# EAGLE design RamyunControlBoard (EAGLE 8.0.0)
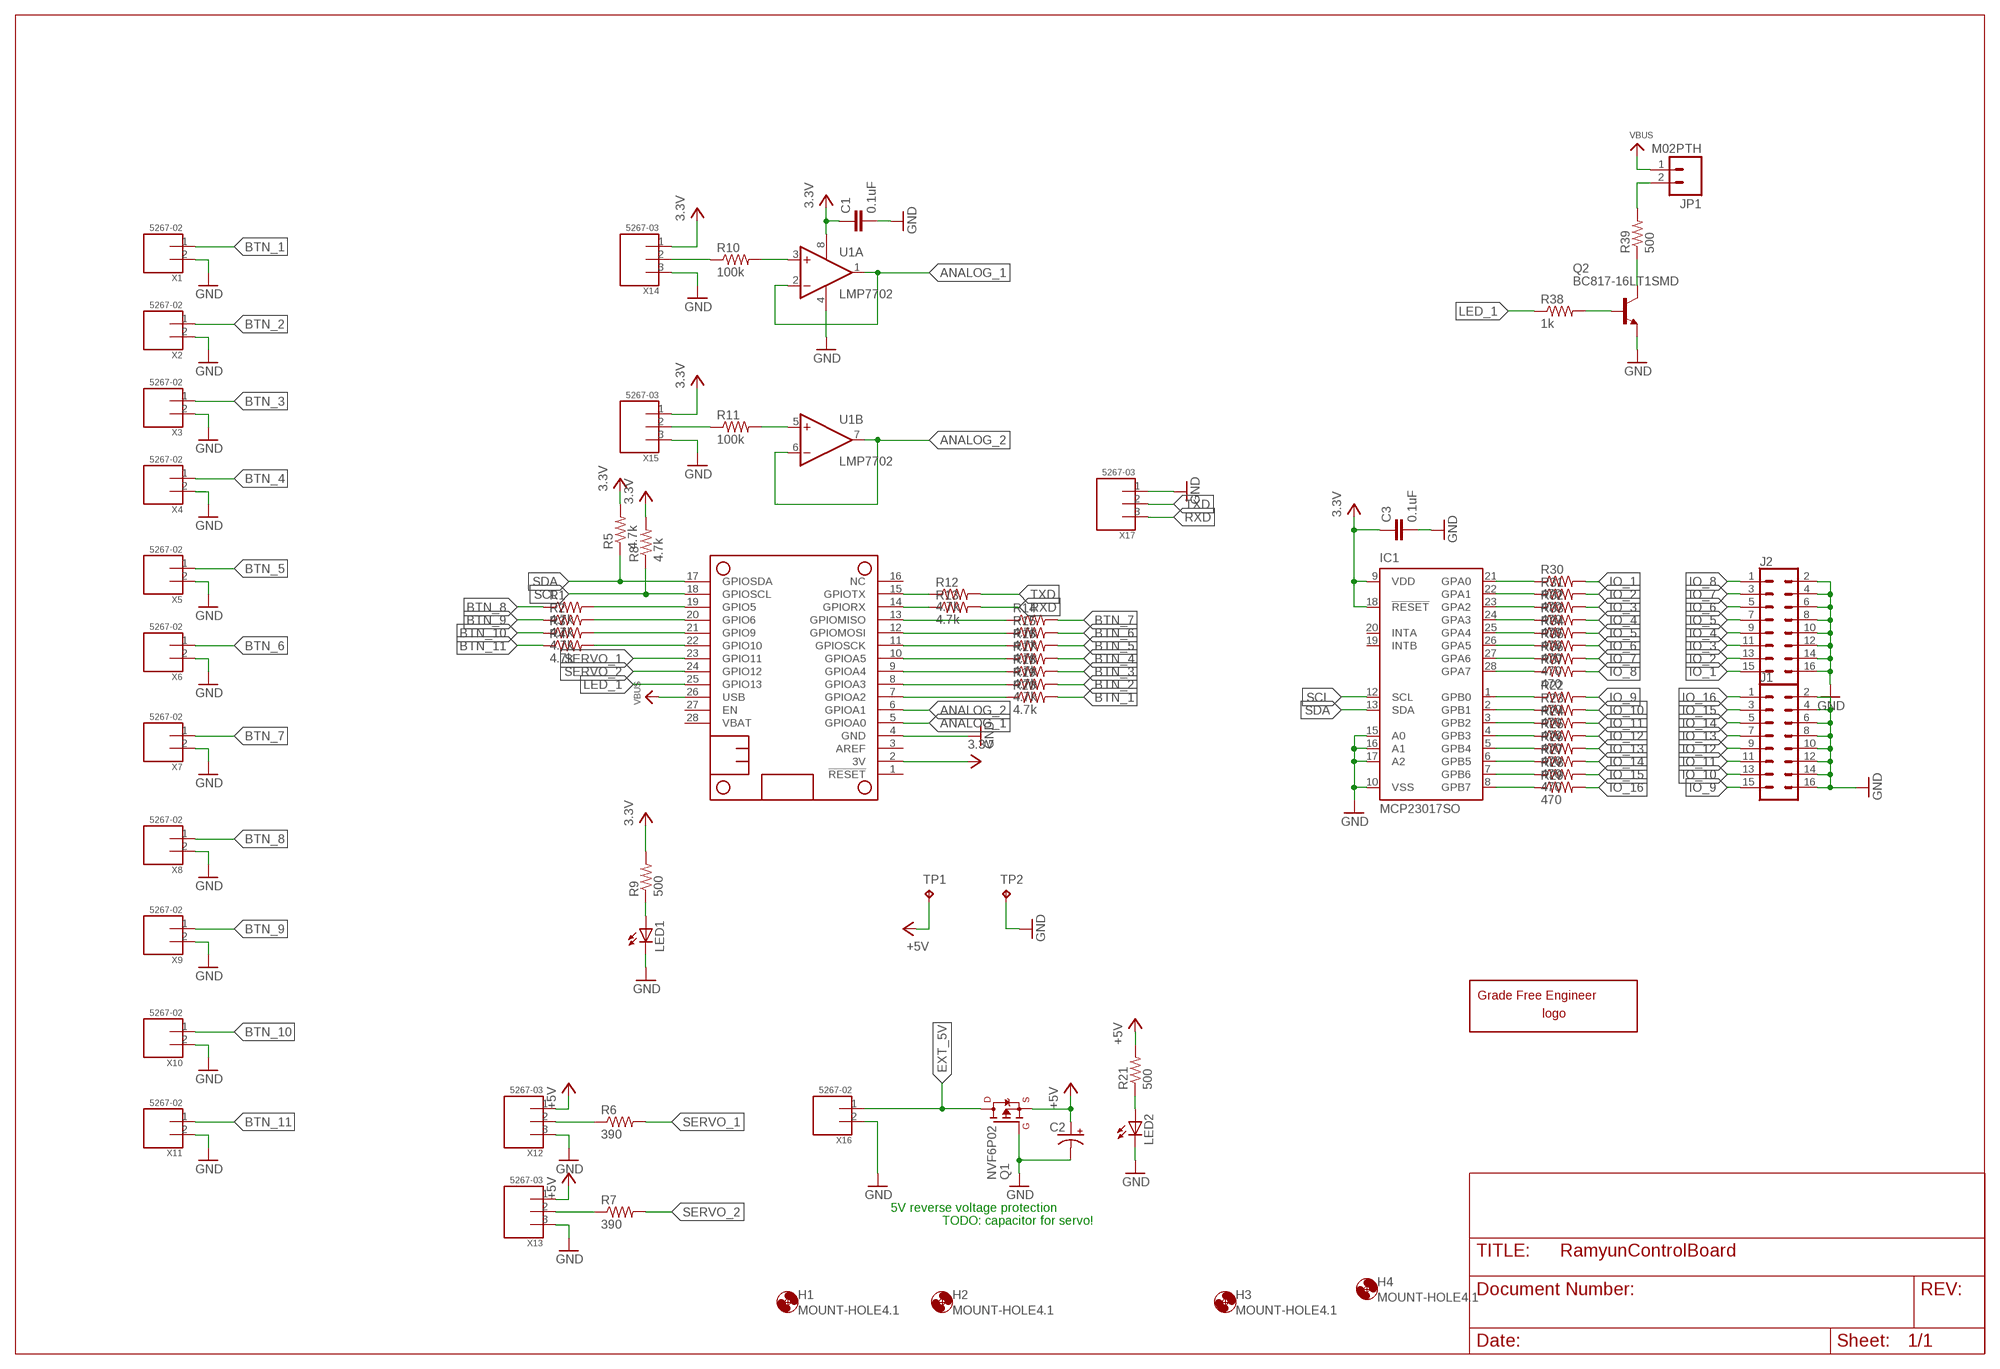
[diagram p0: schematic, sheet 1]

## Parts
C1  0.1uF  C0603(1608)_HAND  [C0603(1608)_HANDSOLDER]
C2  CPOL-USE3.5-8  [E3,5-8]
C3  0.1uF  C0603(1608)_HAND  [C0603(1608)_HANDSOLDER]
H1  MOUNT-HOLE4.1  [4,1]
H2  MOUNT-HOLE4.1  [4,1]
H3  MOUNT-HOLE4.1  [4,1]
H4  MOUNT-HOLE4.1  [4,1]
IC1  MCP23017SO  [SO28W]
J1  CONN_08X2  [2X8]
J2  CONN_08X2  [2X8]
JP1  M02PTH  [1X02]
LED1  LED3MM  [LED3MM]
LED2  LED3MM  [LED3MM]
LOGO1  GRADEFREELOGO-20  [GRADEFREELOGO-20]
MS1  FEATHERWING_NODIM  [FEATHERWING_DIM]
Q1  NVF6P02  [SOT223]
Q2  BC817-16LT1SMD  [SOT23-BEC]
R1  4.7k  R0603(1608)_HAND  [R0603(1608)_HANDSOLDER]
R2  4.7k  R0603(1608)_HAND  [R0603(1608)_HANDSOLDER]
R3  4.7k  R0603(1608)_HAND  [R0603(1608)_HANDSOLDER]
R4  4.7k  R0603(1608)_HAND  [R0603(1608)_HANDSOLDER]
R5  4.7k  R0603(1608)_HAND  [R0603(1608)_HANDSOLDER]
R6  390  R0603(1608)_HAND  [R0603(1608)_HANDSOLDER]
R7  390  R0603(1608)_HAND  [R0603(1608)_HANDSOLDER]
R8  4.7k  R0603(1608)_HAND  [R0603(1608)_HANDSOLDER]
R9  500  R0603(1608)_HAND  [R0603(1608)_HANDSOLDER]
R10  100k  R0603(1608)_HAND  [R0603(1608)_HANDSOLDER]
R11  100k  R0603(1608)_HAND  [R0603(1608)_HANDSOLDER]
R12  4.7k  R0603(1608)_HAND  [R0603(1608)_HANDSOLDER]
R13  4.7k  R0603(1608)_HAND  [R0603(1608)_HANDSOLDER]
R14  4.7k  R0603(1608)_HAND  [R0603(1608)_HANDSOLDER]
R15  4.7k  R0603(1608)_HAND  [R0603(1608)_HANDSOLDER]
R16  4.7k  R0603(1608)_HAND  [R0603(1608)_HANDSOLDER]
R17  4.7k  R0603(1608)_HAND  [R0603(1608)_HANDSOLDER]
R18  4.7k  R0603(1608)_HAND  [R0603(1608)_HANDSOLDER]
R19  4.7k  R0603(1608)_HAND  [R0603(1608)_HANDSOLDER]
R20  4.7k  R0603(1608)_HAND  [R0603(1608)_HANDSOLDER]
R21  500  R0603(1608)_HAND  [R0603(1608)_HANDSOLDER]
R22  470  R0603(1608)_HAND  [R0603(1608)_HANDSOLDER]
R23  470  R0603(1608)_HAND  [R0603(1608)_HANDSOLDER]
R24  470  R0603(1608)_HAND  [R0603(1608)_HANDSOLDER]
R25  470  R0603(1608)_HAND  [R0603(1608)_HANDSOLDER]
R26  470  R0603(1608)_HAND  [R0603(1608)_HANDSOLDER]
R27  470  R0603(1608)_HAND  [R0603(1608)_HANDSOLDER]
R28  470  R0603(1608)_HAND  [R0603(1608)_HANDSOLDER]
R29  470  R0603(1608)_HAND  [R0603(1608)_HANDSOLDER]
R30  470  R0603(1608)_HAND  [R0603(1608)_HANDSOLDER]
R31  470  R0603(1608)_HAND  [R0603(1608)_HANDSOLDER]
R32  470  R0603(1608)_HAND  [R0603(1608)_HANDSOLDER]
R33  470  R0603(1608)_HAND  [R0603(1608)_HANDSOLDER]
R34  470  R0603(1608)_HAND  [R0603(1608)_HANDSOLDER]
R35  470  R0603(1608)_HAND  [R0603(1608)_HANDSOLDER]
R36  470  R0603(1608)_HAND  [R0603(1608)_HANDSOLDER]
R37  470  R0603(1608)_HAND  [R0603(1608)_HANDSOLDER]
R38  1k  R0603(1608)_HAND  [R0603(1608)_HANDSOLDER]
R39  500  R0603(1608)_HAND  [R0603(1608)_HANDSOLDER]
TP1  TP-5010  [TP-5010]
TP2  TP-5010  [TP-5010]
U1  LMP7702  [DGK_S-DPSO-G8]
X1  5267-02  [5267-02]
X2  5267-02  [5267-02]
X3  5267-02  [5267-02]
X4  5267-02  [5267-02]
X5  5267-02  [5267-02]
X6  5267-02  [5267-02]
X7  5267-02  [5267-02]
X8  5267-02  [5267-02]
X9  5267-02  [5267-02]
X10  5267-02  [5267-02]
X11  5267-02  [5267-02]
X12  5267-03  [5267-03]
X13  5267-03  [5267-03]
X14  5267-03  [5267-03]
X15  5267-03  [5267-03]
X16  5267-02  [5267-02]
X17  5267-03  [5267-03]

## Nets
3.3V: C1.1 C3.1 IC1.9(VDD) IC1.18(!RESET) MS1.2(3V) R5.2 R8.2 R9.2 U1.8(V+) X14.1 X15.1
+5V: C2.+ Q1.3(S) R21.2 TP1.TP X12.1 X13.1
ANALOG_1: MS1.5(GPIOA0) U1.1(A:OUT) U1.2(A:-IN)
ANALOG_2: MS1.6(GPIOA1) U1.6(B:-IN) U1.7(B:OUT)
BTN_1: R20.2 X1.1
BTN_2: R19.2 X2.1
BTN_3: R18.2 X3.1
BTN_4: R17.2 X4.1
BTN_5: R16.2 X5.1
BTN_6: R15.2 X6.1
BTN_7: R14.2 X7.1
BTN_8: R1.1 X8.1
BTN_9: R2.1 X9.1
BTN_10: R3.1 X10.1
BTN_11: R4.1 X11.1
EXT_5V: Q1.2(D) Q1.4(D) X16.1
GND: C1.2 C2.- C3.2 IC1.10(VSS) IC1.15(A0) IC1.16(A1) IC1.17(A2) J1.2 J1.4 J1.6 J1.8 J1.10 J1.12 J1.14 J1.16 J2.2 J2.4 J2.6 J2.8 J2.10 J2.12 J2.14 J2.16 LED1.K(C) LED2.K(C) MS1.4(GND) Q1.1(G) Q2.E TP2.TP U1.4(V-) X1.2 X2.2 X3.2 X4.2 X5.2 X6.2 X7.2 X8.2 X9.2 X10.2 X11.2 X12.3 X13.3 X14.3 X15.3 X16.2 X17.1
IO_1: J2.15 R30.2
IO_2: J2.13 R31.2
IO_3: J2.11 R32.2
IO_4: J2.9 R33.2
IO_5: J2.7 R34.2
IO_6: J2.5 R35.2
IO_7: J2.3 R36.2
IO_8: J2.1 R37.2
IO_9: J1.15 R22.2
IO_10: J1.13 R23.2
IO_11: J1.11 R24.2
IO_12: J1.9 R25.2
IO_13: J1.7 R26.2
IO_14: J1.5 R27.2
IO_15: J1.3 R28.2
IO_16: J1.1 R29.2
LED_1: MS1.25(GPIO13) R38.1
N$1: MS1.7(GPIOA2) R20.1
N$2: R10.2 U1.3(A:+IN)
N$3: R11.2 U1.5(B:+IN)
N$4: MS1.8(GPIOA3) R19.1
N$5: MS1.9(GPIOA4) R18.1
N$6: MS1.10(GPIOA5) R17.1
N$7: R11.1 X15.2
N$8: R10.1 X14.2
N$9: MS1.19(GPIO5) R1.2
N$10: MS1.20(GPIO6) R2.2
N$11: MS1.21(GPIO9) R3.2
N$12: MS1.22(GPIO10) R4.2
N$13: MS1.15(GPIOTX) R12.1
N$14: MS1.14(GPIORX) R13.1
N$15: MS1.11(GPIOSCK) R16.1
N$16: MS1.12(GPIOMOSI) R15.1
N$17: MS1.13(GPIOMISO) R14.1
N$18: IC1.21(GPA0) R30.1
N$19: IC1.22(GPA1) R31.1
N$20: IC1.23(GPA2) R32.1
N$21: IC1.24(GPA3) R33.1
N$22: IC1.25(GPA4) R34.1
N$23: IC1.26(GPA5) R35.1
N$24: IC1.27(GPA6) R36.1
N$25: IC1.28(GPA7) R37.1
N$26: IC1.1(GPB0) R22.1
N$27: IC1.2(GPB1) R23.1
N$28: IC1.3(GPB2) R24.1
N$29: IC1.4(GPB3) R25.1
N$30: IC1.5(GPB4) R26.1
N$31: IC1.6(GPB5) R27.1
N$32: IC1.7(GPB6) R28.1
N$33: IC1.8(GPB7) R29.1
N$34: R6.1 X12.2
N$35: R7.1 X13.2
N$36: LED2.A R21.1
N$50: Q2.C R39.1
N$51: Q2.B R38.2
N$52: JP1.2 R39.2
N$53: LED1.A R9.1
RXD: R13.2 X17.3
SCL: IC1.12(SCL) MS1.18(GPIOSCL) R8.1
SDA: IC1.13(SDA) MS1.17(GPIOSDA) R5.1
SERVO_1: MS1.23(GPIO11) R6.2
SERVO_2: MS1.24(GPIO12) R7.2
TXD: R12.2 X17.2
VBUS: JP1.1 MS1.26(USB)
Unconnected: IC1.19(INTB) IC1.20(INTA) MS1.1(!RESET) MS1.3(AREF) MS1.16(NC) MS1.27(EN) MS1.28(VBAT)

## Notes on the sheet
- 5V reverse voltage protection
- TODO: capacitor for servo!

## Library data of the parts
C1 C3 = GFE:C
C2 = adafruit:CPOL-US: POLARIZED CAPACITOR, American symbol
H1-H4 = holes:MOUNT-HOLE: MOUNTING HOLE with drill center marker
IC1 = GFE:MCP23017: http://ww1.microchip.com/downloads/en/DeviceDoc/21952a.pdf Source: http://ww1.microchip.com/downloads/en/DeviceDoc/21952a.pdf
J1 J2 = SparkFun-Connectors:CONN_08X2: Multi connection point. Often used as Generic Header-pin footprint for 0.1 inch spaced/style header connections You can populate with any combo of single row headers, but if you'd like an exact match, check this: Header - 2x8 (Male, 0.1") <https://www.sparkfun.com/products/13156> (PRT-13156) On any of the 0.1 inch spaced packages, you can populate with these: Break Away Headers - Straight <https://www.sparkfun.com/products/116> (PRT-00116) Break Away Male Headers - Right Angle <https://www.sparkfun.com/products/553> (PRT-00553) Female Headers <https://www.sparkfun.com/products/115> (PRT-00115) Break Away Headers - Machine Pin <https://www.sparkfun.com/products/117> (PRT-00117) Break Away Female Headers - Swiss Machine Pin <https://www.sparkfun.com/products/743> (PRT-00743)
JP1 = berry:M02: Standard 2-pin 0.1" header. Use with - straight break away headers ( PRT-00116) - right angle break away headers (PRT-00553) - swiss pins (PRT-00743) - machine pins (PRT-00117) - female headers (PRT-00115) Molex polarized connector foot print use with: PRT-08233 with associated crimp pins and housings. 2.54_SCREWTERM for use with PRT-10571. 3.5mm Screw Terminal footprints for PRT-08084 5mm Screw Terminal footprints for use with PRT-08433
LED1 LED2 = GFE:LED: LEDs Standard schematic elements and footprints for 5mm, 3mm, 1206, and 0603 sized LEDs. 5mm - Spark Fun Electronics SKU : COM-00529 (and others)
LOGO1 = GFE:GRADEFREELOGO
MS1 = GFE:FEATHERWING
Q1 = GFE:NVF6P02
Q2 = GFE:BC817*: NPN Transistor
R1-R39 = GFE:R
TP1 TP2 = berry:TP
U1 = GFE:LMP7702
X1-X11 X16 = GFE:5267-02
X12-X15 X17 = GFE:5267-03

## Board
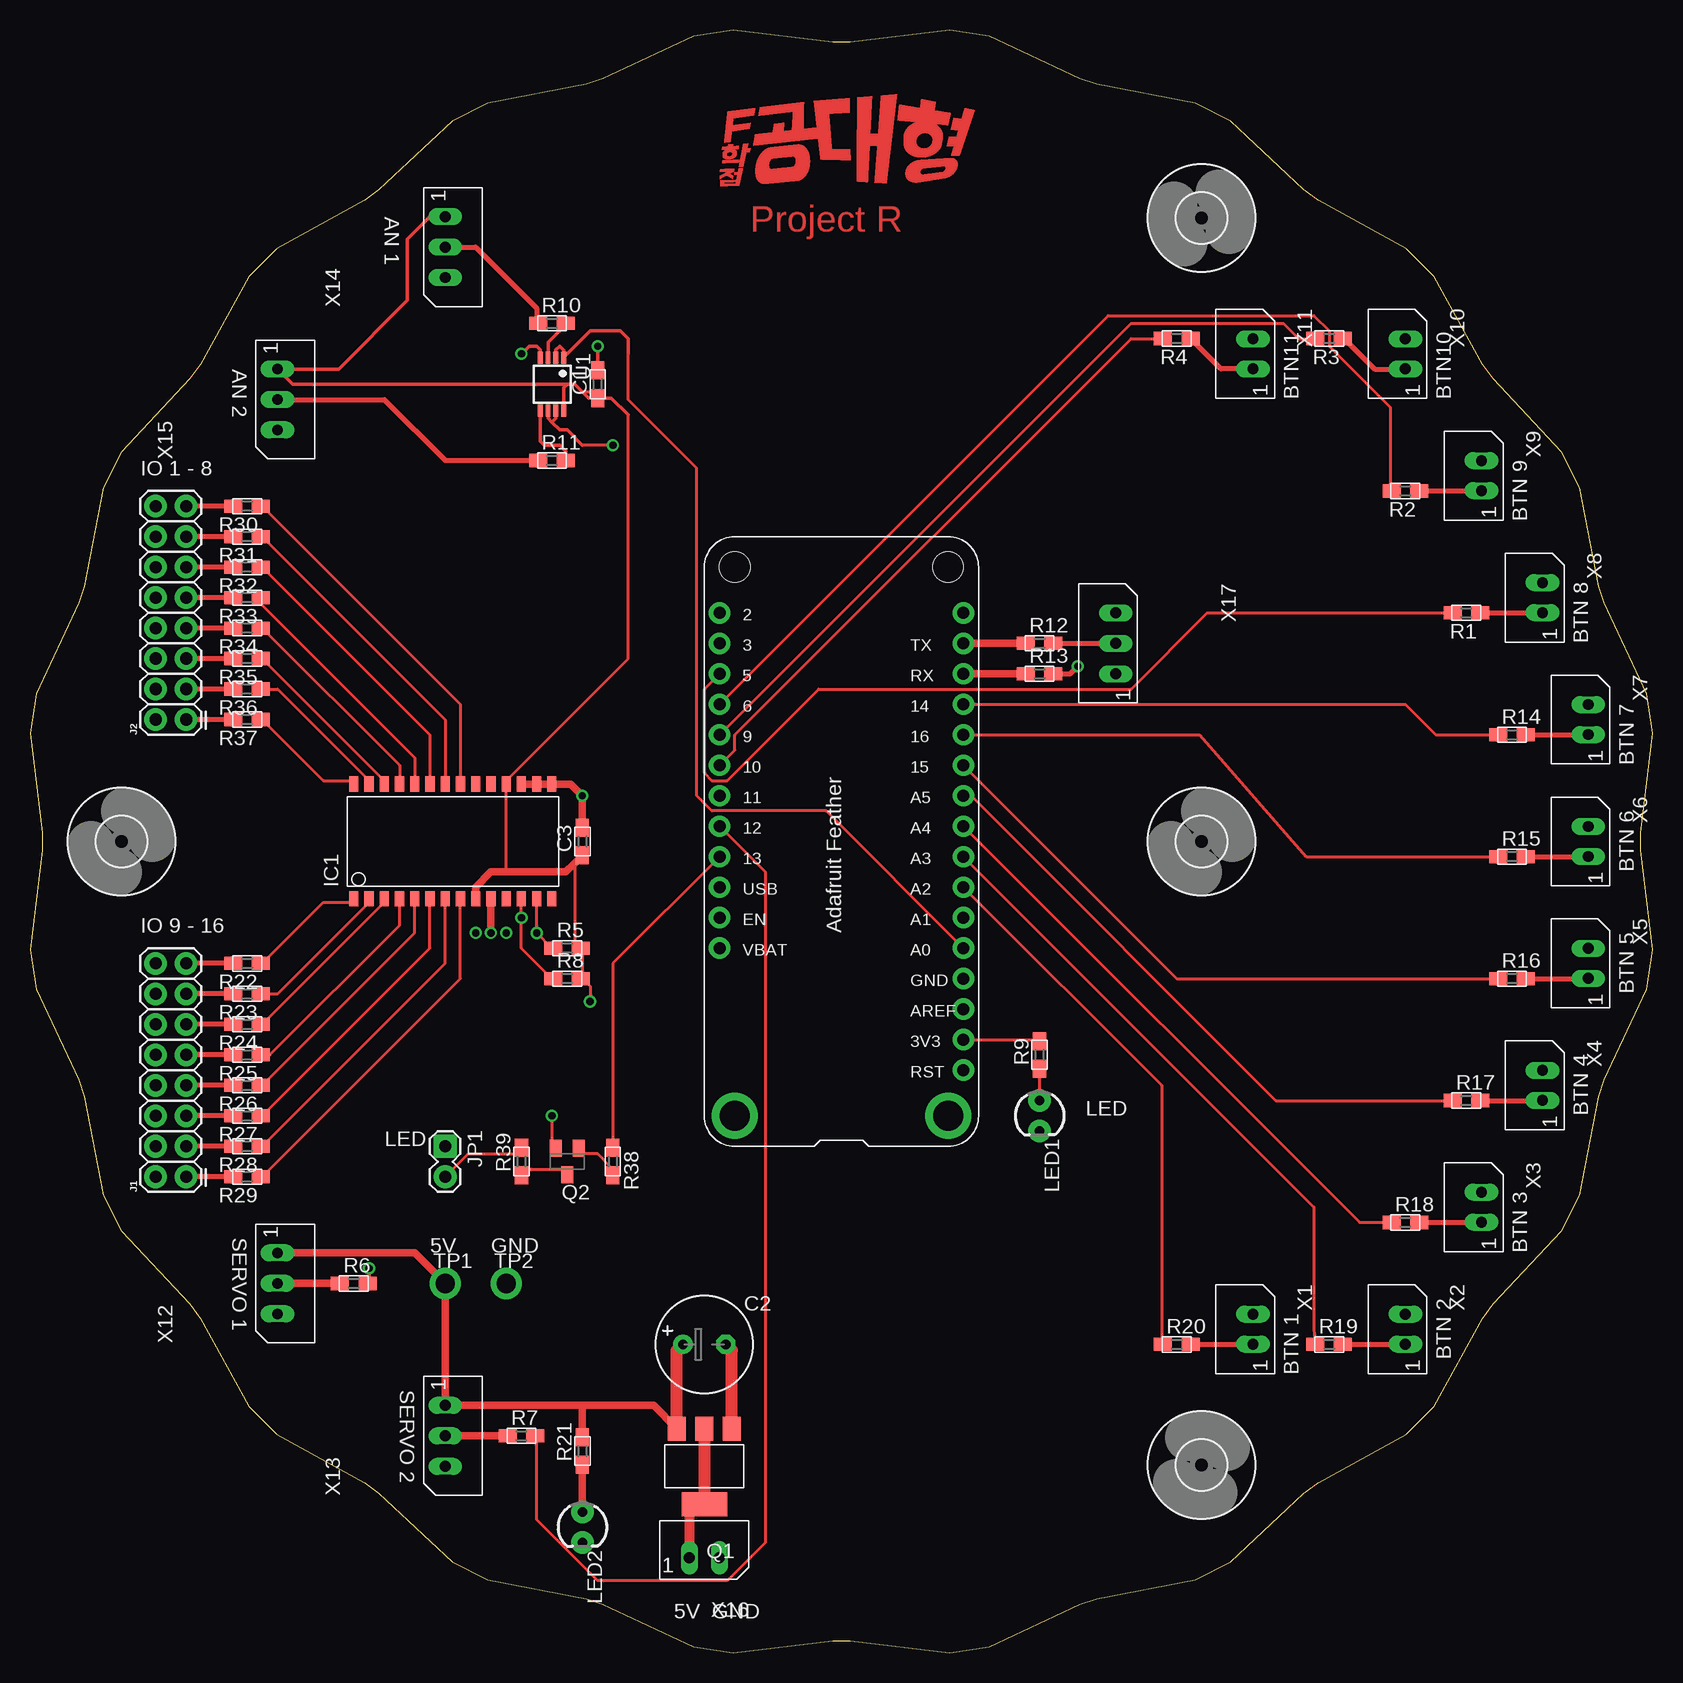
[diagram p1: board, top side]
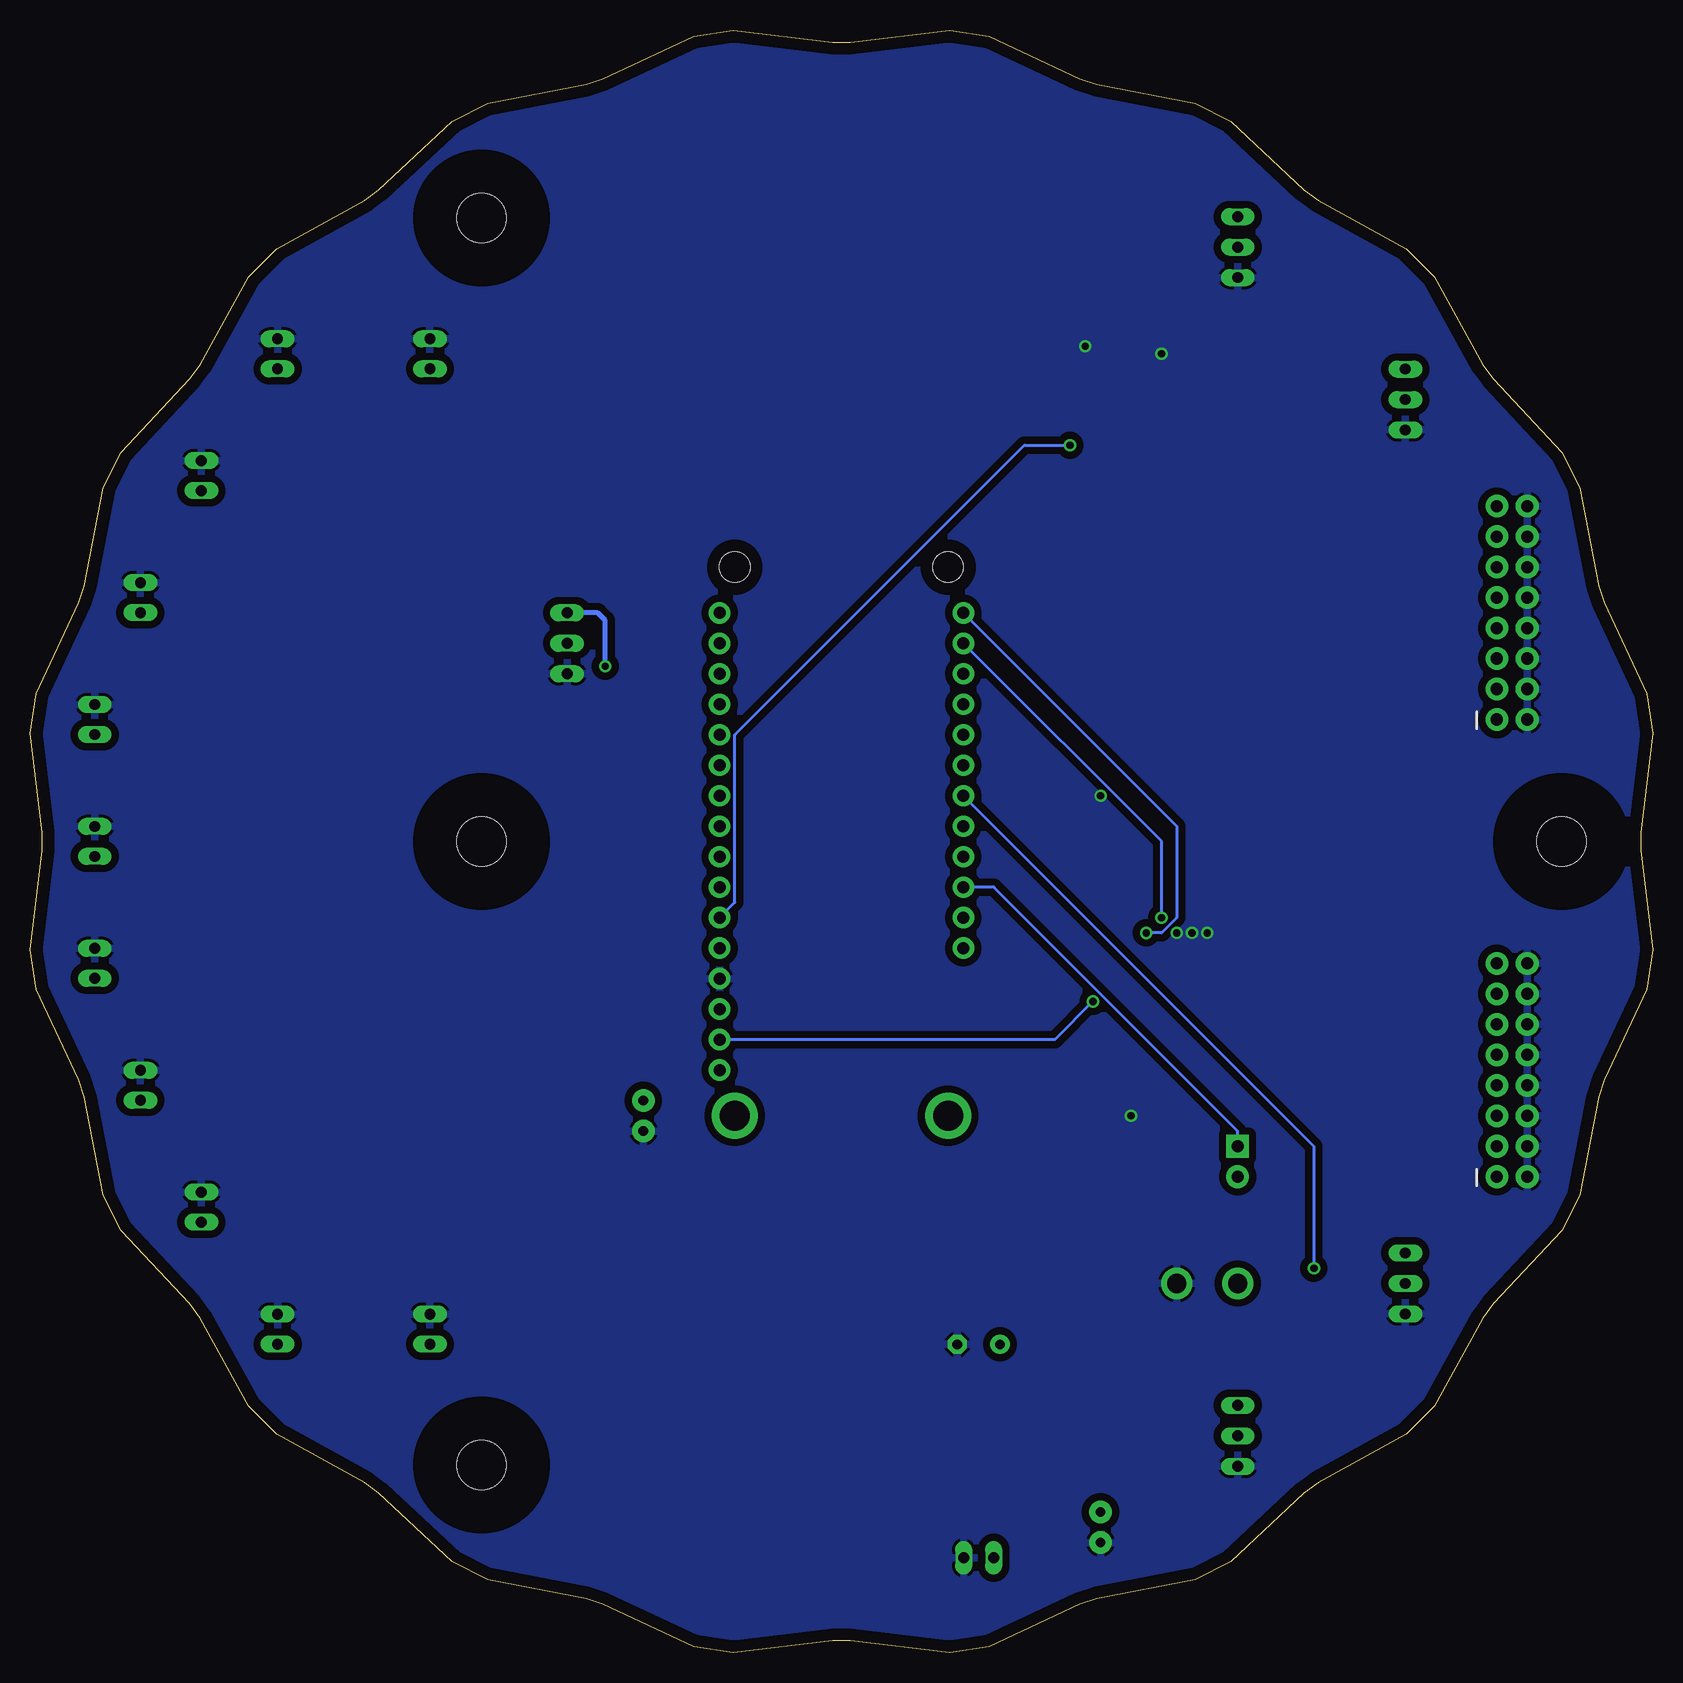
[diagram p2: board, bottom side, seen from below]

Size 135.24 x 135.24 mm. Coordinates in mm from the lower left corner, seen from the top.
Outline: 46.34,4.52 47.75,4.06 55.31,0.52 58.6,0 66.88,1.03 68.36,1.03 76.65,0 79.93,0.52 87.5,4.06 88.9,4.52 97.1,6.1 100.07,7.61 106.17,13.31 107.36,14.18 114.67,18.22 117.02,20.57 121.06,27.88 121.93,29.08 127.64,35.18 129.15,38.14 130.73,46.34 131.18,47.75 134.72,55.31 135.24,58.6 134.21,66.88 134.21,68.36 135.24,76.65 134.72,79.93 131.18,87.5 130.73,88.9 129.15,97.1 127.64,100.07 121.93,106.17 121.06,107.36 117.02,114.67 114.67,117.02 107.36,121.06 106.17,121.93 100.07,127.64 97.1,129.15 88.9,130.73 87.5,131.18 79.93,134.72 76.65,135.24 68.36,134.21 66.88,134.21 58.6,135.24 55.31,134.72 47.75,131.18 46.34,130.73 38.14,129.15 35.18,127.64 29.08,121.93 27.88,121.06 20.57,117.02 18.22,114.67 14.18,107.36 13.31,106.17 7.61,100.07 6.1,97.1 4.52,88.9 4.06,87.5 0.52,79.93 0,76.65 1.03,68.36 1.03,66.88 0,58.6 0.52,55.31 4.06,47.75 4.52,46.34 6.1,38.14 7.61,35.18 13.31,29.08 14.18,27.88 18.22,20.57 20.57,18.22 27.88,14.18 29.08,13.31 35.18,7.61 38.14,6.1 46.34,4.52
Copper layers (1*16): Top 0.035mm / dielectric 1.5mm / Bottom 0.035mm
Design rules "default": minimum track width 10mil, minimum drill 24mil, track to track 8mil, track to pad 8mil, pad to pad 8mil, via to via 8mil, smd to smd 8mil, copper to edge 40mil, drill to drill 8mil, minimum pad ring 10mil, minimum via ring 8mil, stop-mask expansion 4mil, vias tented up to drill 0mil, thermal gap 10mil

### Footprints (pad centres in the part's own frame; a part is rotated, then mirrored left to right if it is on the bottom)
C0603(1608)_HANDSOLDER = smd 1.5 x 1.1: 1 -1.15,0; 2 1.15,0
E3,5-8 = drill 0.813 pad 1.6: + -1.778,0 | drill 0.813 pad 1.6 octagon: - 1.778,0
4,1 = hole 4.1: 0,0
SO28W = smd 0.762 x 1.27: 1 -7.62,-4.78; 2 -6.35,-4.78; 3 -5.08,-4.78; 4 -3.81,-4.78; 5 -2.54,-4.78; 6 -1.27,-4.78; 7 0,-4.78; 8 1.27,-4.78; 9 2.54,-4.78; 10 3.81,-4.78; 11 5.08,-4.78; 12 6.35,-4.78; 13 7.62,-4.78; 14 8.89,-4.78; 15 8.89,4.78; 16 7.62,4.78; 17 6.35,4.78; 18 5.08,4.78; 19 3.81,4.78; 20 2.54,4.78; 21 1.27,4.78; 22 0,4.78; 23 -1.27,4.78; 24 -2.54,4.78; 25 -3.81,4.78; 26 -5.08,4.78; 27 -6.35,4.78; 28 -7.62,4.78
2X8 = drill 1.016 pad 1.88: 1 0,0; 2 0,2.54; 3 2.54,0; 4 2.54,2.54; 5 5.08,0; 6 5.08,2.54; 7 7.62,0; 8 7.62,2.54; 9 10.16,0; 10 10.16,2.54; 11 12.7,0; 12 12.7,2.54; 13 15.24,0; 14 15.24,2.54; 15 17.78,0; 16 17.78,2.54
1X02 = drill 1.016 pad 1.88 square: 1 0,0 | drill 1.016 pad 1.88: 2 2.54,0
LED3MM = drill 0.813 pad 1.88: A -1.27,0; K 1.27,0
FEATHERWING_DIM = drill 1 pad 1.778: 1 -19.05,-10.16; 2 -16.51,-10.16; 3 -13.97,-10.16; 4 -11.43,-10.16; 5 -8.89,-10.16; 6 -6.35,-10.16; 7 -3.81,-10.16; 8 -1.27,-10.16; 9 1.27,-10.16; 10 3.81,-10.16; 11 6.35,-10.16; 12 8.89,-10.16; 13 11.43,-10.16; 14 13.97,-10.16; 15 16.51,-10.16; 16 19.05,-10.16; 17 19.05,10.16; 18 16.51,10.16; 19 13.97,10.16; 20 11.43,10.16; 21 8.89,10.16; 22 6.35,10.16; 23 3.81,10.16; 24 1.27,10.16; 25 -1.27,10.16; 26 -3.81,10.16; 27 -6.35,10.16; 28 -8.89,10.16 | drill 2.5 pad 3.81: P$1 -22.86,8.89; P$2 -22.86,-8.89 | hole 2.54: 22.86,8.89; 22.86,-8.89
SOT223 = smd 1.5 x 2: 1 -2.3,-3.15; 2 0,-3.15; 3 2.3,-3.15 | smd 3.8 x 2: 4 0,3.15
SOT23-BEC = smd 1 x 1.4: B -0.95,-1.1; C 0,1.1; E 0.95,-1.1
R0603(1608)_HANDSOLDER = smd 1.5 x 1.1: 1 -1.15,0; 2 1.15,0
TP-5010 = drill 1.6 pad 2.6: TP 0,0
DGK_S-DPSO-G8 = smd 0.4 x 1: 1 -0.975,-2.2; 2 -0.325,-2.2; 3 0.325,-2.2; 4 0.975,-2.2; 5 0.975,2.2; 6 0.325,2.2; 7 -0.325,2.2; 8 -0.975,2.2
5267-02 = drill 0.9 long: 1 1.25,0; 2 -1.25,0
5267-03 = drill 0.9 long: 1 2.54,0; 2 0,0; 3 -2.54,0

### Placement (x,y rotation side)
C1  47.3,105.72 90 top
C2  56.19,25.71 0 top
C3  46.03,67.62 90 top
H1  97.62,15.66 30 top
H2  97.62,119.58 330 top
H3  7.62,67.62 0 top
H4  97.62,67.62 0 top
IC1  34.6,67.62 0 top
J1  13.01,39.68 90 top
J2  13.01,77.78 90 top
JP1  34.6,42.22 270 top
LED1  84.13,44.76 270 top
LED2  46.03,10.47 270 top
LOGO1  57.46,122.23 0 top
MS1  67.62,67.62 90 top
Q1  56.19,15.55 180 top
Q2  44.76,40.95 180 top
R1  119.69,86.67 180 top
R2  114.61,96.83 180 top
R3  108.26,109.53 180 top
R4  95.56,109.53 180 top
R5  44.76,58.73 0 top
R6  26.98,30.79 0 top
R7  40.95,18.09 0 top
R8  44.76,56.19 0 top
R9  84.13,49.84 90 top
R10  43.49,110.8 0 top
R11  43.49,99.37 0 top
R12  84.13,84.13 0 top
R13  84.13,81.59 0 top
R14  123.5,76.51 0 top
R15  123.5,66.35 0 top
R16  123.5,56.19 0 top
R17  119.69,46.03 0 top
R18  114.61,35.87 0 top
R19  108.26,25.71 0 top
R20  95.56,25.71 0 top
R21  46.03,16.82 90 top
R22  18.09,57.46 180 top
R23  18.09,54.92 180 top
R24  18.09,52.38 180 top
R25  18.09,49.84 180 top
R26  18.09,47.3 180 top
R27  18.09,44.76 180 top
R28  18.09,42.22 180 top
R29  18.09,39.68 180 top
R30  18.09,95.56 180 top
R31  18.09,93.02 180 top
R32  18.09,90.48 180 top
R33  18.09,87.94 180 top
R34  18.09,85.4 180 top
R35  18.09,82.86 180 top
R36  18.09,80.32 180 top
R37  18.09,77.78 180 top
R38  48.57,40.95 270 top
R39  40.95,40.95 90 top
TP1  34.6,30.79 0 top
TP2  39.68,30.79 0 top
U1  43.49,105.72 180 top
X1  101.91,26.98 270 top
X2  114.61,26.98 270 top
X3  120.96,37.14 270 top
X4  126.04,47.3 270 top
X5  129.85,57.46 270 top
X6  129.85,67.62 270 top
X7  129.85,77.78 270 top
X8  126.04,87.94 270 top
X9  120.96,98.1 270 top
X10  114.61,108.26 270 top
X11  101.91,108.26 270 top
X12  20.63,30.79 90 top
X13  34.6,18.09 90 top
X14  34.6,117.15 90 top
X15  20.63,104.45 90 top
X16  56.19,7.93 180 top
X17  90.48,84.13 270 top

### Tracks (layer width: path | path; a pad name or v marks a point on that pad's centre or on a via)
3.3V  (via drill 0.61)
  Top 0.254: MS1.2 84.13,51.11 R9.2 | 46.03,56.19 46.03,58.73 R5.2 45.4,58.73 45.4,65.72 45.34,65.78 | 46.03,105.09 47.3,105.09 C1.1 | 39.68,65.08 IC1.18 39.68,72.7 49.84,82.86 49.84,103.18 | v46.67,54.29 46.67,55.56 46.03,56.19 | 46.03,56.19 R8.2
  Top 0.305: 46.55,104.57 46.03,105.09 45.4,105.72 44.76,105.72 | 44.76,105.72 21.9,105.72 X15.1 25.71,106.99 31.43,112.71 31.43,117.79 33.33,119.69 X14.1 | C1.1 48.45,104.57 49.84,103.18 | U1.8 44.47,105.43 44.76,105.72
  Top 0.61: IC1.9 37.14,63.81 38.41,65.08 39.68,65.08 44.64,65.08 45.34,65.78 C3.1
  Bottom 0.254: MS1.2 49.84,51.11 v46.67,54.29
+5V
  Top 0.61: X12.1 32.06,33.33 TP1.TP X13.1 46.03,20.63 | 46.03,20.63 51.96,20.63 Q1.3 | R21.2 46.03,20.63
  Top 1.016: Q1.3 53.89,25.19 C2.+
ANALOG_1
  Top 0.254: 49.84,108.26 49.84,104.45 55.56,98.74 55.56,71.43 56.83,70.16 66.35,70.16 MS1.5
  Top 0.305: U1.2 43.82,108.59 44.13,108.9 44.47,108.56 U1.1 44.47,107.97 46.67,110.17 49.21,110.17 49.84,109.53 49.84,108.26
ANALOG_2  (via drill 0.61)
  Top 0.254: v48.57,100.64 46.03,100.64
  Top 0.305: U1.6 43.17,102.87 43.49,102.55 | U1.7 43.82,102.87 43.49,102.55 | 43.49,102.55 44.13,101.91 44.76,101.91 46.03,100.64
  Bottom 0.254: v48.57,100.64 52.38,100.64 76.51,76.51 76.51,62.54 MS1.6
BTN_1
  Top 0.406: R20.2 101.89,25.71 X1.1
BTN_2
  Top 0.406: R19.2 114.59,25.71 X2.1
BTN_3
  Top 0.406: R18.2 120.94,35.87 X3.1
BTN_4
  Top 0.406: R17.2 126.02,46.03 X4.1
BTN_5
  Top 0.406: R16.2 129.83,56.19 X5.1
BTN_6
  Top 0.406: R15.2 129.83,66.35 X6.1
BTN_7
  Top 0.406: R14.2 129.83,76.51 X7.1
BTN_8
  Top 0.406: R1.1 126.02,86.67 X8.1
BTN_9
  Top 0.406: R2.1 120.94,96.83 X9.1
BTN_10
  Top 0.406: R3.1 109.53,109.53 112.07,106.99 114.59,106.99 X10.1
BTN_11
  Top 0.406: X11.1 99.23,107.01 R4.1
EXT_5V
  Top 0.813: Q1.4 55.58,12.4 54.92,11.74 54.92,7.95 X16.1
  Top 1.016: Q1.2 Q1.4
GND  (via drill 0.6)
  Top 0.254: v43.49,44.76 43.49,42.22 Q2.E
  Top 0.305: C1.2 v47.3,108.9 | U1.4 42.52,108.6 42.22,108.9 41.59,108.9 v40.95,108.26
  Top 0.61: IC1.10 v38.41,60 | C3.2 v46.03,71.43 45.06,72.4 IC1.15 IC1.16 IC1.17
  Top 1.016: Q1.1 58.49,25.19 C2.-
  other vias: 39.68,60 37.14,60
  pour Bottom (isolate 0.61): -2.23,62.77 -2.23,72.47 arc-90 64.04,137.47 72.47,137.47 arc-90 137.47,72.47 137.47,62.77 arc-90 72.47,-2.23 62.77,-2.23 arc-90
IO_1
  Top 0.406: R30.2 J2.15
IO_2
  Top 0.406: R31.2 J2.13
IO_3
  Top 0.406: R32.2 J2.11
IO_4
  Top 0.406: R33.2 J2.9
IO_5
  Top 0.406: R34.2 J2.7
IO_6
  Top 0.406: R35.2 J2.5
IO_7
  Top 0.406: R36.2 J2.3
IO_8
  Top 0.406: R37.2 J2.1
IO_9
  Top 0.406: R22.2 J1.15
IO_10
  Top 0.406: R23.2 J1.13
IO_11
  Top 0.406: R24.2 J1.11
IO_12
  Top 0.406: R25.2 J1.9
IO_13
  Top 0.406: R26.2 J1.7
IO_14
  Top 0.406: R27.2 J1.5
IO_15
  Top 0.406: R28.2 J1.3
IO_16
  Top 0.406: R29.2 J1.1
LED_1
  Top 0.254: R38.1 48.57,57.46 MS1.25
N$1
  Top 0.254: MS1.7 94.29,47.3 94.29,25.71 R20.1
N$2
  Top 0.305: U1.3 43.17,109.21 44.64,110.68 R10.2
N$3
  Top 0.305: R11.2 44.64,100.13 44.13,100.64 42.86,100.64 42.52,100.98 U1.5
N$4
  Top 0.254: MS1.8 106.99,37.14 106.99,26.98 R19.1
N$5
  Top 0.254: R18.1 110.8,35.87 MS1.9
N$6
  Top 0.254: R17.1 103.82,46.03 78.42,71.43 MS1.10
N$7
  Top 0.406: X15.2 29.52,104.45 34.6,99.37 R11.1
N$8
  Top 0.406: X14.2 37.14,117.15 42.22,112.07 42.22,110.92 R10.1
N$9
  Top 0.254: R1.2 98.1,86.67 91.75,80.32 65.72,80.32 58.1,72.7 56.83,72.7 56.19,73.34 56.19,80.32 MS1.19
N$10
  Top 0.254: MS1.20 89.85,111.44 106.99,111.44 108.26,110.17 108.26,108.9 113.34,103.82 113.34,96.83 R2.2
N$11
  Top 0.254: R3.2 105.72,109.53 104.45,110.8 91.75,110.8 MS1.21
N$12
  Top 0.254: R4.2 91.75,109.53 58.73,76.51 58.73,75.24 MS1.22
N$13
  Top 0.61: MS1.15 R12.1
N$14
  Top 0.61: MS1.14 R13.1
N$15
  Top 0.254: R16.1 95.56,56.19 MS1.11
N$16
  Top 0.254: R15.1 106.36,66.35 97.47,76.51 MS1.12
N$17
  Top 0.254: MS1.13 114.61,79.05 117.15,76.51 R14.1
N$18
  Top 0.254: IC1.21 35.87,79.05 19.36,95.56 R30.1
N$19
  Top 0.254: IC1.22 34.6,77.78 19.36,93.02 R31.1
N$20
  Top 0.254: IC1.23 33.33,76.51 19.36,90.48 R32.1
N$21
  Top 0.254: IC1.24 32.06,74.61 18.73,87.94 R33.1
N$22
  Top 0.254: IC1.25 30.79,73.97 19.36,85.4 R34.1
N$23
  Top 0.254: IC1.26 29.52,72.7 19.36,82.86 R35.1
N$24
  Top 0.254: R36.1 20.63,80.32 28.25,72.7 IC1.27
N$25
  Top 0.254: IC1.28 26.98,72.7 24.44,72.7 19.36,77.78 R37.1
N$26
  Top 0.254: IC1.1 26.98,62.54 24.44,62.54 19.36,57.46 R22.1
N$27
  Top 0.254: R23.1 20.63,54.92 28.25,62.54 IC1.2
N$28
  Top 0.254: IC1.3 29.52,62.54 19.36,52.38 R24.1
N$29
  Top 0.254: IC1.4 30.79,60.64 20,49.84 R25.1
N$30
  Top 0.254: IC1.5 32.06,60 19.36,47.3 R26.1
N$31
  Top 0.254: IC1.6 33.33,58.73 19.36,44.76 R27.1
N$32
  Top 0.254: IC1.7 34.6,57.46 19.36,42.22 R28.1
N$33
  Top 0.254: IC1.8 35.87,56.19 19.36,39.68 R29.1
N$34
  Top 0.61: R6.1 X12.2
N$35
  Top 0.61: X13.2 R7.1
N$36
  Top 0.61: R21.1 LED2.A
N$50
  Top 0.254: Q2.C 44.76,40.32 40.95,40.32 R39.1
N$51
  Top 0.254: Q2.B 46.03,41.59 47.3,41.59 48.57,40.32 R38.2
N$52
  Top 0.254: JP1.2 36.51,41.59 40.95,41.59 R39.2
N$53
  Top 0.254: LED1.A R9.1
RXD  (via drill 0.6)
  Top 0.406: R13.2 86.67,81.59 v87.31,82.23
  Bottom 0.406: v87.31,82.23 87.31,86.04 87.94,86.67 X17.3
SCL  (via drill 0.61)
  Top 0.254: IC1.12 v40.95,61.27 40.95,58.73 43.49,56.19 R8.1
  Bottom 0.254: MS1.18 40.95,67.62 v40.95,61.27
SDA  (via drill 0.61)
  Top 0.254: IC1.13 v42.22,60 43.49,58.73 R5.1
  Bottom 0.254: v42.22,60 40.95,60 39.68,61.27 39.68,68.89 MS1.17
SERVO_1  (via drill 0.61)
  Top 0.254: v28.25,32.06 28.25,30.79 R6.2
  Bottom 0.254: v28.25,32.06 28.25,42.22 MS1.23
SERVO_2
  Top 0.254: MS1.24 61.27,65.08 61.27,9.2 58.1,6.03 47.3,6.03 42.22,11.11 42.22,18.09 R7.2
TXD
  Top 0.406: R12.2 X17.2
VBUS
  Bottom 0.254: MS1.26 54.92,63.81 34.6,43.49 JP1.1

### Text on the board
Top: Project R
tPlace: AN 1 | AN 2 | BTN11 | BTN10 | IO 1 - 8 | BTN 9 | BTN 8 | BTN 7 | BTN 6 | IO 9 - 16 | BTN 5 | LED | BTN 4 | LED | SERVO 1 | 5V | GND | BTN 3 | BTN 2 | BTN 1 | SERVO 2 | 5V | GND
tStop: Project R